# EAGLE design breakout_ble113 (EAGLE 7.4.0)
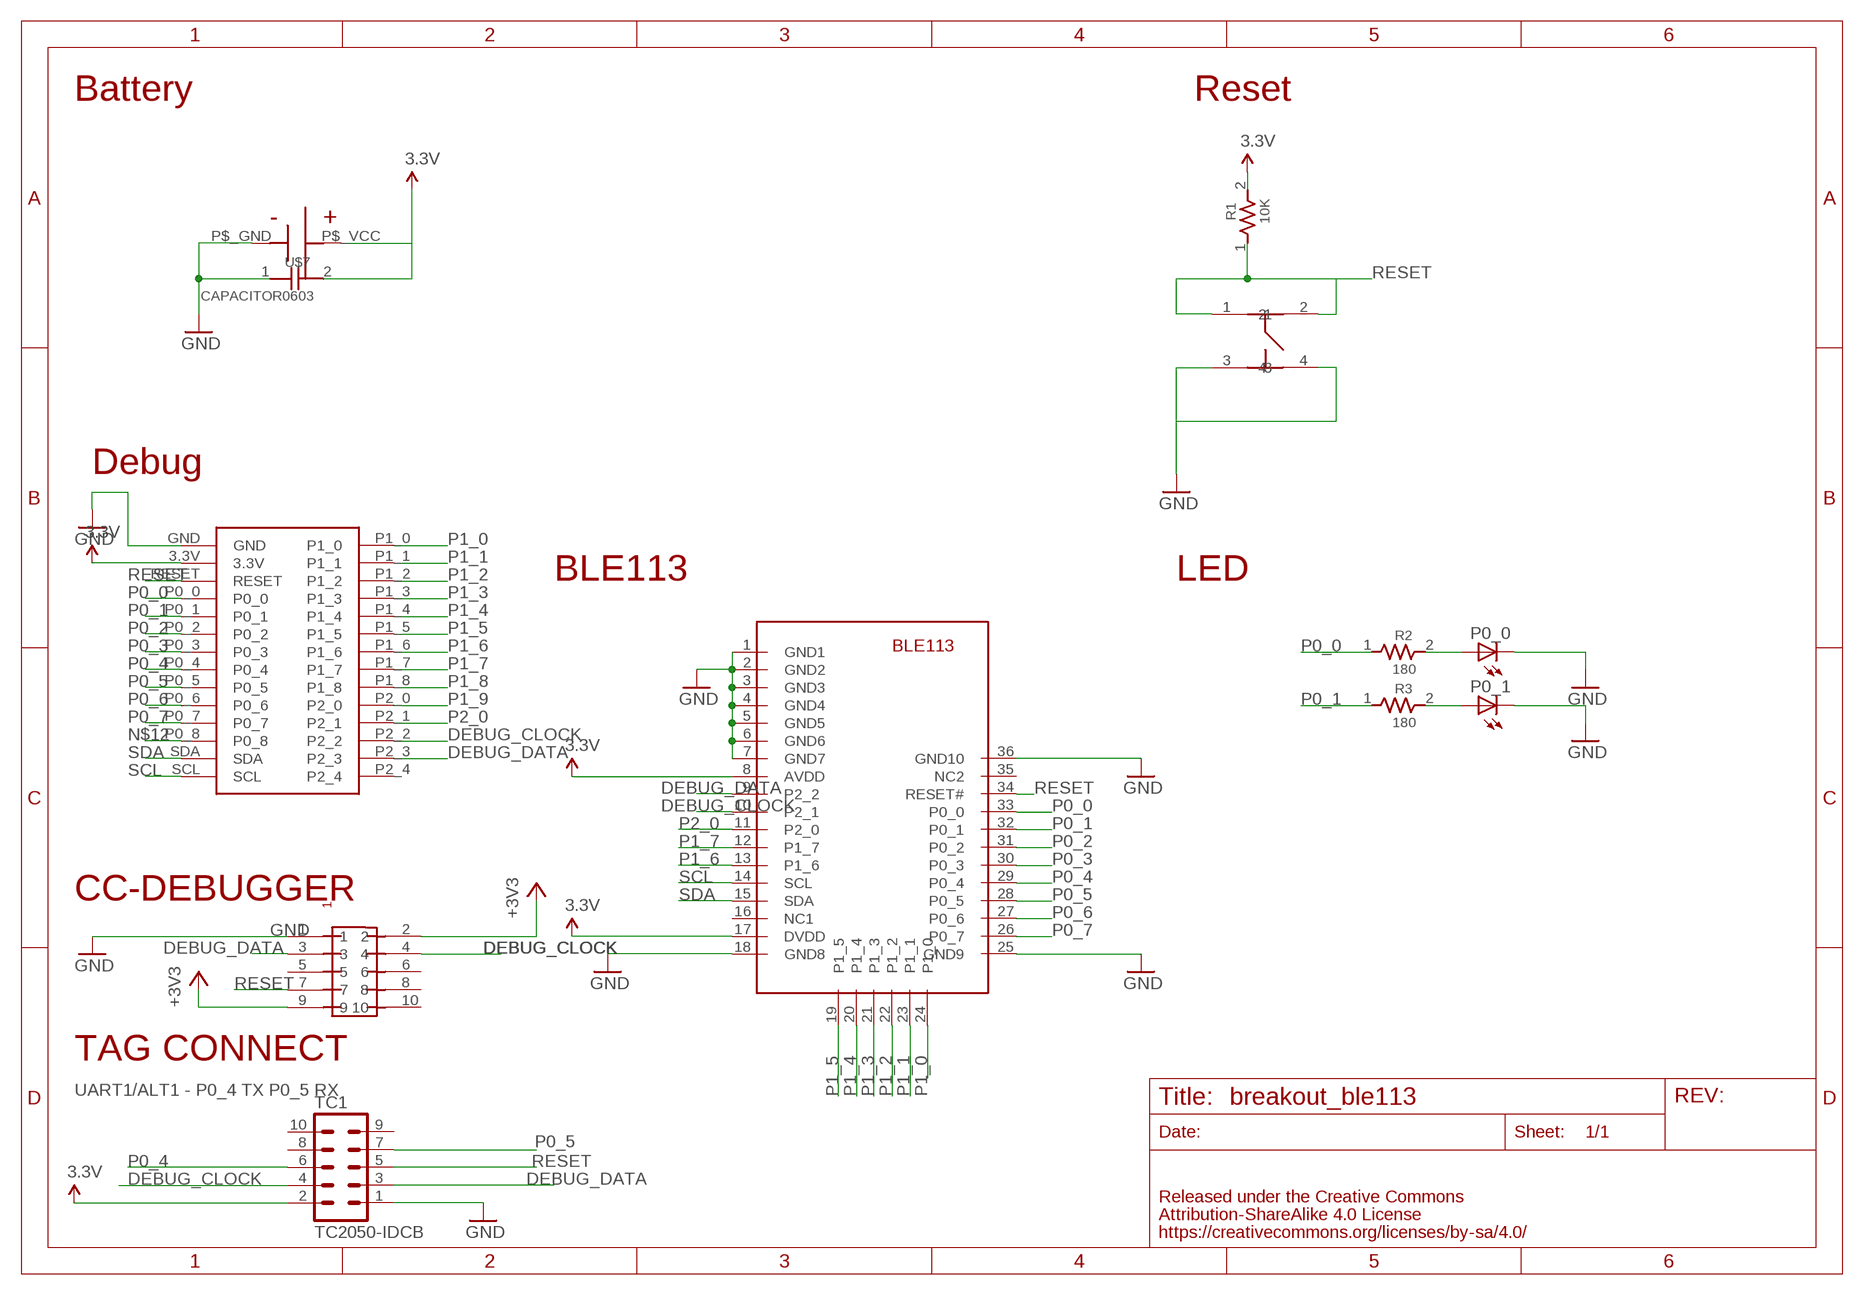
[diagram p0: schematic, sheet 1]

## Parts
P0_0  LEDCHIP-LED0603  [CHIP-LED0603]
P0_1  LEDCHIP-LED0603  [CHIP-LED0603]
R1  10K  RESISTOR0603  [0603]
R2  180  RESISTOR0603  [0603]
R3  180  RESISTOR0603  [0603]
TC1  TC2050-IDCB  [TC2050-IDC]
U$1  PIN-HEADER-SMT(1.27MM)2X5  [PIN-HEADER-SMT(1.27MM)2X5]
U$2  BREAKOUT_BLE  [BREAKOUT_BLE]
U$3  BLUEGIGA-BLE113  [BLUEGIGA-BLE113]
U$4  SMTU2450-TOP  [SMTU2450]
U$5  SWICTH-4P(KMR2)  [SWITCH-4P(KMR2)]
U$7  CAPACITOR0603  [0603]

## Nets
3.3V: R1.2 TC1.2 U$2.3.3V U$3.8(AVDD) U$3.17(DVDD) U$4.P$_VCC(+) U$7.2
+3V3: U$1.2 U$1.9
DEBUG_CLOCK: TC1.4 U$1.4 U$2.P2_2 U$3.10(P2_1)
DEBUG_DATA: TC1.3 U$1.3 U$2.P2_3 U$3.9(P2_2)
GND: P0_0.C P0_1.C TC1.1 U$1.1 U$2.GND U$3.1(GND1) U$3.2(GND2) U$3.3(GND3) U$3.4(GND4) U$3.5(GND5) U$3.6(GND6) U$3.7(GND7) U$3.18(GND8) U$3.25(GND9) U$3.36(GND10) U$4.P$_GND(-) U$5.3 U$5.4 U$7.1
N$12: U$2.P0_8
P0_0: R2.1 U$2.P0_0 U$3.33(P0_0)
P0_1: R3.1 U$2.P0_1 U$3.32(P0_1)
P0_2: U$2.P0_2 U$3.31(P0_2)
P0_3: U$2.P0_3 U$3.30(P0_3)
P0_4: TC1.6 U$2.P0_4 U$3.29(P0_4)
P0_5: TC1.7 U$2.P0_5 U$3.28(P0_5)
P0_6: U$2.P0_6 U$3.27(P0_6)
P0_7: U$2.P0_7 U$3.26(P0_7)
P1_0: U$2.P1_0 U$3.24(P1_0)
P1_1: U$2.P1_1 U$3.23(P1_1)
P1_2: U$2.P1_2 U$3.22(P1_2)
P1_3: U$2.P1_3 U$3.21(P1_3)
P1_4: U$2.P1_4 U$3.20(P1_4)
P1_5: U$2.P1_5 U$3.19(P1_5)
P1_6: U$2.P1_6 U$3.13(P1_6)
P1_7: U$2.P1_7 U$3.12(P1_7)
P1_8: U$2.P1_8
P1_9: U$2.P2_0
P2_0: U$2.P2_1 U$3.11(P2_0)
R1: P0_1.A R3.2
R2: P0_0.A R2.2
RESET: R1.1 TC1.5 U$1.7 U$2.RESET U$3.34(RESET#) U$5.1 U$5.2
SCL: U$2.SCL U$3.14(SCL)
SDA: U$2.SDA U$3.15(SDA)
Unconnected: TC1.8 TC1.9 TC1.10 U$1.5 U$1.6 U$1.8 U$1.10 U$2.P2_4 U$3.16(NC1) U$3.35(NC2)

## Notes on the sheet
- Battery | Reset
- Debug
- BLE113 | LED
- CC-DEBUGGER
- TAG CONNECT
- UART1/ALT1 - P0_4 TX P0_5 RX

## Library data of the parts
P0_0 P0_1 = led:LED: LED OSRAM: - CHIPLED LG R971, LG N971, LY N971, LG Q971, LY Q971, LO R971, LY R971 LH N974, LH R974 LS Q976, LO Q976, LY Q976 LO Q996 - Hyper CHIPLED LW Q18S LB Q993, LB Q99A, LB R99A - SideLED LS A670, LO A670, LY A670, LG A670, LP A670 LB A673, LV A673, LT A673, LW A673 LH A674 LY A675 LS A676, LA A676, LO A676, LY A676, LW A676 LS A679, LY A679, LG A679 - Hyper Micro SIDELED® LS Y876, LA Y876, LO Y876, LY Y876 LT Y87S - SmartLED LW L88C, LW L88S LB L89C, LB L89S, LG L890 LS L89K, LO L89K, LY L89K LS L896, LA L896, LO L896, LY L896 - TOPLED LS T670, LO T670, LY T670, LG T670, LP T670 LSG T670, LSP T670, LSY T670, LOP T670, LYG T670 LG T671, LOG T671, LSG T671 LB T673, LV T673, LT T673, LW T673 LH T674 LS T676, LA T676, LO T676, LY T676, LB T676, LH T676, LSB T676, LW T676 LB T67C, LV T67C, LT T67C, LS T67K, LO T67K, LY T67K, LW E67C LS E67B, LA E67B, LO E67B, LY E67B, LB E67C, LV E67C, LT E67C LW T67C LS T679, LY T679, LG T679 LS T770, LO T770, LY T770, LG T770, LP T770 LB T773, LV T773, LT T773, LW T773 LH T774 LS E675, LA E675, LY E675, LS T675 LS T776, LA T776, LO T776, LY T776, LB T776 LHGB T686 LT T68C, LB T68C - Hyper Mini TOPLED® LB M676 - Mini TOPLED Santana® LG M470 LS M47K, LO M47K, LY M47K Source: http://www.osram.convergy.de LUXEON: - LUMILED® LXK2-PW12-R00, LXK2-PW12-S00, LXK2-PW14-U00, LXK2-PW14-V00 LXK2-PM12-R00, LXK2-PM12-S00, LXK2-PM14-U00 LXK2-PE12-Q00, LXK2-PE12-R00, LXK2-PE12-S00, LXK2-PE14-T00, LXK2-PE14-U00 LXK2-PB12-K00, LXK2-PB12-L00, LXK2-PB12-M00, LXK2-PB14-N00, LXK2-PB14-P00, LXK2-PB14-Q00 LXK2-PR12-L00, LXK2-PR12-M00, LXK2-PR14-Q00, LXK2-PR14-R00 LXK2-PD12-Q00, LXK2-PD12-R00, LXK2-PD12-S00 LXK2-PH12-R00, LXK2-PH12-S00 LXK2-PL12-P00, LXK2-PL12-Q00, LXK2-PL12-R00 Source: www.luxeon.com KINGBRIGHT: KA-3528ASYC Source: www.kingbright.com
R1-R3 = GClue-Resistors:RESISTOR
TC1 = TagConnect:TC2050-IDC: Tag-Connect In Circuit Programming & Debug Cable 10 Pin http://www.tag-connect.com
U$1 = gclue:PIN-HEADER-SMT(1.27MM)2X5: PIN-HEADER-SMT (1.27MM) 2x5
U$2 = gclue:BREAKOUT_BLE
U$3 = GClueBT:BLUEGIGA-BLE113: Bluegiga BLE113 Bluetooth Bluetooth 4.0 low energy radio Radio Transmit power: +0 dBm Receiver sensitivity: -93 dBm Typical line-of-sight range: 30 - 100 meters Current Consumption TX peak current: 18.2 mA, 14.3 ma (with DC/DC) RX peak current: 17.9 mA Power mode 1: 270 uA Power mode 2: 1 uA Power mode 3: 0.4 uA Certifications Japan: MIC Japan( 007-AB0103)
U$4 = GClue-Supply:SMTU2450-TOP
U$5 = gclue-test:SWICTH-4P(KMR2)
U$7 = GClue-Capacitor:CAPACITOR

## Net classes
0 default: width 0.203 mm, clearance 0.254 mm

## Board
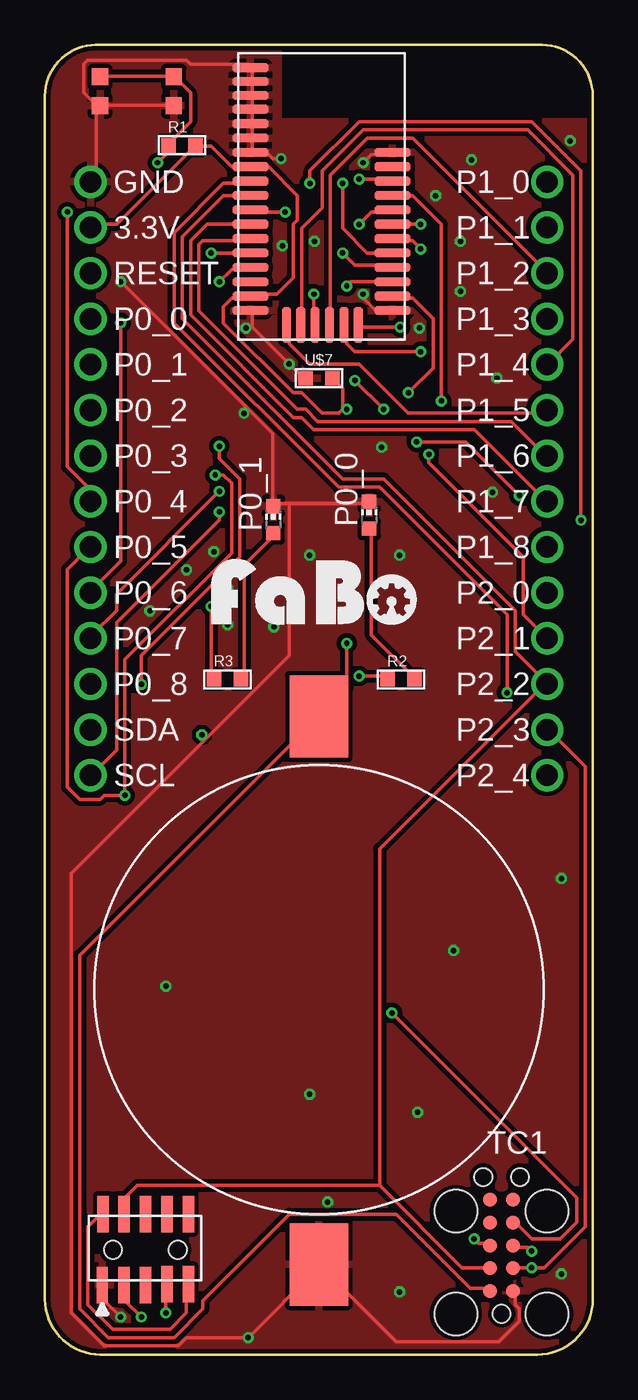
[diagram p1: board, top side]
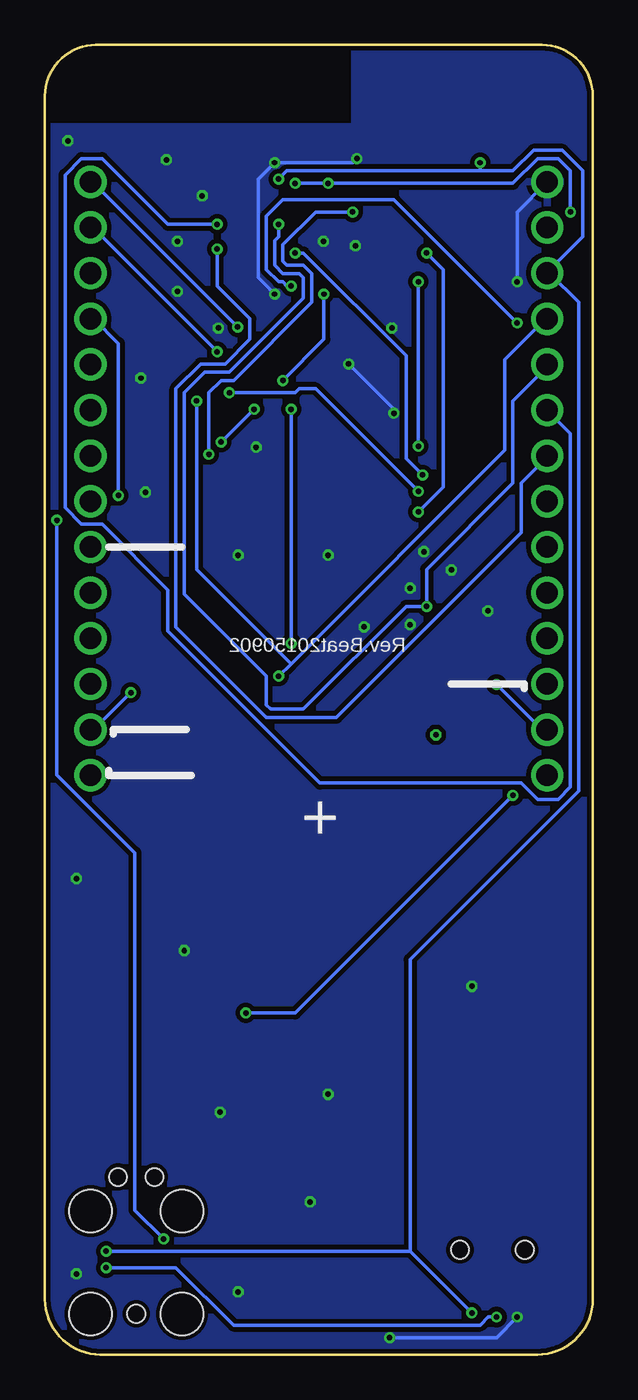
[diagram p2: board, bottom side, seen from below]

Size 30.48 x 72.88 mm. Coordinates in mm from the lower left corner, seen from the top.
Copper layers (1*16): Top 0.035mm / dielectric 1.5mm / Bottom 0.035mm
Design rules "SeeedStudio_2layer_DRU_no_angle_20140221": minimum track width 6mil, minimum drill 12mil, track to track 6mil, track to pad 6mil, pad to pad 6mil, via to via 6mil, smd to smd 0mil, copper to edge 10mil, drill to drill 10mil, minimum pad ring 10mil, minimum via ring 6mil, stop-mask expansion 2mil, vias tented up to drill 100mil, thermal gap 10mil
tRestrict: area 13.2,68.8 to 33.5,74.4
bRestrict: area 13.5,68.6 to 33.5,74.4

### Footprints (pad centres in the part's own frame; a part is rotated, then mirrored left to right if it is on the bottom)
CHIP-LED0603 = smd 0.8 x 0.8: A 0,-0.75; C 0,0.75
0603 = smd 0.8 x 0.8: 1 -0.75,0; 2 0.75,0
TC2050-IDC = smd 0.787 x 0.787: 1 -2.54,-0.635; 2 -2.54,0.635; 3 -1.27,-0.635; 4 -1.27,0.635; 5 0,-0.635; 6 0,0.635; 7 1.27,-0.635; 8 1.27,0.635; 9 2.54,-0.635; 10 2.54,0.635 | hole 0.991: -3.81,0; 3.81,1.016; 3.81,-1.016 | hole 2.375: -3.81,2.54; -3.81,-2.54; 1.905,2.54; 1.905,-2.54
PIN-HEADER-SMT(1.27MM)2X5 = smd 0.635 x 2.032: 1 -2.4,-1.95; 2 -2.35,2; 3 -1.2,-1.95; 4 -1.2,2; 5 0,-1.95; 6 0,2; 7 1.2,-1.9; 8 1.2,2; 9 2.4,-1.9; 10 2.4,2 | hole 1: 1.8,0; -1.8,0
BREAKOUT_BLE = drill 1.2: 3.3V -12.7,10.16; GND -12.7,12.7; P0_0 -12.7,5.08; P0_1 -12.7,2.54; P0_2 -12.7,0; P0_3 -12.7,-2.54; P0_4 -12.7,-5.08; P0_5 -12.7,-7.62; P0_6 -12.7,-10.16; P0_7 -12.7,-12.7; P0_8 -12.7,-15.24; P1_0 12.7,12.7; P1_1 12.7,10.16; P1_2 12.7,7.62; P1_3 12.7,5.08; P1_4 12.7,2.54; P1_5 12.7,0; P1_6 12.7,-2.54; P1_7 12.7,-5.08; P1_8 12.7,-7.62; P2_0 12.7,-10.16; P2_1 12.7,-12.7; P2_2 12.7,-15.24; P2_3 12.7,-17.78; P2_4 12.7,-20.32; RESET -12.7,7.62; SCL -12.7,-20.32; SDA -12.7,-17.78
BLUEGIGA-BLE113 = smd 2 x 0.5: 1 -3.81,6.35; 2 -3.81,5.58; 3 -3.81,4.81; 4 -3.81,4.04; 5 -3.81,3.24; 6 -3.81,2.44; 7 -3.81,1.64; 8 -3.81,0.84; 9 -3.81,0.04; 10 -3.81,-0.76; 11 -3.81,-1.56; 12 -3.81,-2.36; 13 -3.81,-3.16; 14 -3.81,-3.96; 15 -3.81,-4.76; 16 -3.81,-5.56; 17 -3.81,-6.36; 18 -3.81,-7.16; 25 4.09,-7.16; 26 4.09,-6.36; 27 4.09,-5.56; 28 4.09,-4.76; 29 4.09,-3.96; 30 4.09,-3.16; 31 4.09,-2.36; 32 4.09,-1.56; 33 4.09,-0.76; 34 4.09,0.04; 35 4.09,0.84; 36 4.09,1.64 | smd 0.5 x 2: 19 -1.81,-7.96; 20 -1.01,-7.96; 21 -0.21,-7.96; 22 0.59,-7.96; 23 1.39,-7.96; 24 2.19,-7.96
SMTU2450 = smd 3.251 x 4.572: P$_GND 0,-15.29; P$_VCC 0,15.21
SWITCH-4P(KMR2) = smd 0.9 x 0.95: 1 -1,0; 2 3.1,0; 3 -1,-1.6; 4 3.1,-1.6

### Placement (x,y rotation side)
P0_0  18.03,46.72 0 top
P0_1  12.7,46.46 0 top
R1  7.62,67.29 0 top
R2  19.81,37.57 0 top
R3  10.16,37.57 0 top
TC1  25.4,6.08 90 top
U$1  5.59,5.82 0 top
U$2  15.24,52.56 0 top
U$3  15.24,65.26 0 top
U$4  15.24,20.3 0 top
U$5  4.06,71.1 0 top
U$7  15.24,54.34 0 top
U$8  [LOGO_FABO_M]  14.99,40.62 0 top

### Tracks (layer width: path | path; a pad name or v marks a point on that pad's centre or on a via)
3.3V  (via drill 0.3)
  Top 0.203: 16.56,52.61 16.56,53.75 16.1,54.21 U$7.2 | 16.56,52.61 16.33,52.38 15.42,52.38 14.27,53.52 13.82,53.52 9.93,57.41 9.93,58.33 10.39,58.78 11.3,58.78 U$3.17 11.53,59.01 12.9,59.01 13.82,59.93 13.82,62.9 14.05,63.13 14.05,64.5 12.45,66.1 11.53,66.1 U$3.8 11.3,66.1 10.39,66.1 9.25,67.24 8.56,67.24 R1.2 8.33,67.24 3.99,62.9 2.62,62.9 U$2.3.3V | TC1.2 24.56,3.69 23.65,3.69 19.53,7.81 13.59,7.81 8.79,3.01 8.79,2.55 7.19,0.95 3.53,0.95 1.93,2.55 1.93,22.21 15.19,35.47 U$4.P$_VCC 15.42,35.69 16.79,37.07 v16.79,39.58 | v16.79,52.61 16.56,52.61
  Bottom 0.203: v16.79,39.58 v16.79,52.61
+3V3
  Top 0.203: U$1.9 7.87,3.92 7.87,2.32 6.96,1.4 3.76,1.4 2.39,2.78 2.39,7.12 3.07,7.81 U$1.2
DEBUG_CLOCK
  Top 0.203: 18.62,9.41 23.19,4.83 24.56,4.83 TC1.4 | 18.62,9.41 5.13,9.41 4.44,8.72 4.44,8.03 U$1.4 | U$3.10 11.3,64.5 9.93,64.5 7.64,62.21 7.64,57.64 16.56,48.73 18.85,48.73 26.16,41.41 26.16,39.12 27.76,37.52 U$2.P2_2 27.76,37.3 18.62,28.15 18.62,9.41
DEBUG_DATA  (via drill 0.3)
  Top 0.203: TC1.3 26.16,4.83 v27.08,4.83 27.76,4.83 30.05,7.12 30.05,32.72 27.99,34.78 U$2.P2_3 | v25.7,36.84 25.7,41.18 18.62,48.27 16.33,48.27 7.19,57.41 7.19,62.44 9.93,65.18 11.3,65.18 U$3.9 | v5.36,2.09 4.44,3.01 4.44,3.69 U$1.3
  Bottom 0.203: v25.7,36.84 27.76,34.78 U$2.P2_3 | v5.36,2.09 5.82,2.09 6.27,1.63 19.99,1.63 23.19,4.83 v27.08,4.83
GND  (via drill 0.3)
  Top 0.203: TC1.1 26.16,3.46 26.16,2.78 26.39,2.55 26.39,1.86 25.25,0.72 19.53,0.72 15.42,4.83 U$4.P$_GND 15.19,4.83 v11.3,0.95 7.87,0.95 7.42,0.49 3.3,0.49 1.47,2.32 1.47,26.78 13.59,38.9 13.59,47.35 | v4.22,2.09 3.3,3.01 3.3,3.69 U$1.1 | v17.7,59.01 17.7,58.78 18.39,58.1 19.3,58.1 U$3.25 | v17.7,66.33 18.16,66.78 19.3,66.78 U$3.36 | U$7.1 14.27,54.44 v13.59,55.12 11.53,57.18 11.53,58.1 U$3.18 | 13.59,47.35 17.93,47.35 P0_0.C | 13.59,47.35 12.9,47.35 P0_1.C 12.67,47.35 12.67,51.24 11.3,52.61 | U$5.3 3.07,69.53 6.96,69.53 U$5.4 | U$5.3 2.84,69.3 2.84,65.64 2.62,65.41 U$2.GND | v4.22,59.7 11.3,52.61 | U$5.3 2.84,69.53 2.16,70.21 2.16,71.81 2.39,72.04 7.87,72.04 8.1,71.81 11.3,71.81 U$3.1 11.53,71.59 11.53,70.9 U$3.2 11.53,70.67 11.53,70.21 U$3.3 11.53,69.98 11.53,69.53 U$3.4 11.53,69.3 11.53,68.61 U$3.5 11.53,68.38 11.53,67.93 U$3.6 11.53,67.7 11.53,67.01 U$3.7 11.53,66.78 12.45,66.78 12.67,66.56 v13.13,66.56 | 11.3,52.61 v11.07,52.38
  Bottom 0.203: v4.22,2.09 5.36,0.95 v11.3,0.95 | v17.7,59.01 18.62,59.93 18.62,65.41 v17.7,66.33 13.36,66.33 v13.13,66.56 | v4.22,59.7 4.22,63.58 U$2.GND | v13.59,55.12 11.07,52.61 v11.07,52.38
  other vias: 6.73,20.49 14.73,14.49 22.73,22.49 20.73,13.49 28.73,26.49 15.73,8.49 19.73,3.49 12.73,40.49 14.73,44.49 19.73,44.49 28.73,4.49 18.73,50.49 23.73,66.49 21.73,64.49 9.4,44.69 7.87,43.67 5.84,41.38 10.16,42.65 10.16,40.62 25.15,54.34 24.89,47.99 11.18,57.13 14.99,61.96 13.21,61.7 29.21,67.55 23.11,61.96 23.11,59.16 20.83,57.13
  pour Bottom: -1.27,-1.51 32.73,-1.51 32.73,73.49 -1.27,73.49
  pour Top: -1.27,-1.51 32.73,-1.51 32.73,73.49 -1.27,73.49
N$4  (via drill 0.3)
  other vias: 8.73,34.49
P0_0  (via drill 0.3)
  Top 0.203: v17.48,37.75 18.85,37.75 R2.1 | v22.05,53.07 22.05,62.9 20.45,64.5 19.53,64.5 U$3.33
  Bottom 0.203: 16.79,38.44 4.9,50.33 4.9,55.35 2.62,57.64 U$2.P0_0 | 16.79,38.44 v17.48,37.75 | v22.05,53.07 22.05,43.7 16.79,38.44
P0_1  (via drill 0.3)
  Top 0.203: v9.25,41.64 9.25,37.75 R3.1 | v17.48,62.9 18.16,63.58 19.3,63.58 U$3.32
  Bottom 0.203: U$2.P0_1 2.62,54.9 4.44,53.07 4.44,48.5 9.25,43.7 v9.25,41.64 10.39,41.64 16.1,35.92 17.93,35.92 18.16,36.15 18.16,37.75 22.73,42.32 22.73,53.52 21.59,54.67 20.22,54.67 16.1,58.78 16.1,59.93 16.33,60.16 17.25,60.16 17.7,60.61 17.7,61.98 17.48,62.21 v17.48,62.9
P0_2  (via drill 0.3)
  Top 0.203: v20.9,62.9 19.53,62.9 U$3.31
  Bottom 0.203: v20.9,62.9 23.65,62.9 27.3,66.56 28.45,66.56 29.36,65.64 29.36,47.12 28.45,46.21 27.3,46.21 23.65,42.55 23.65,40.27 15.19,31.81 3.99,31.81 3.07,30.89 1.93,30.89 1.24,31.58 1.24,51.24 2.39,52.38 U$2.P0_2
P0_3  (via drill 0.3)
  Top 0.203: v20.9,61.53 20.45,61.98 19.53,61.98 U$3.30
  Bottom 0.203: v20.9,61.53 20.9,59.47 19.07,57.64 19.07,56.5 20.45,55.12 21.82,55.12 23.19,53.75 23.19,40.5 18.16,35.47 14.27,35.47 3.99,45.75 3.99,48.5 2.62,49.87 U$2.P0_3
P0_4  (via drill 0.3)
  Top 0.203: v23.88,6.43 24.1,6.21 24.56,6.21 TC1.6 | v29.82,46.44 29.82,65.87 27.08,68.61 17.48,68.61 14.73,65.87 v14.73,65.18 | v16.56,65.18 16.56,62.67 17.93,61.3 19.3,61.3 U$3.29 | v1.24,63.58 1.24,49.41 2.39,48.27 2.39,47.58 U$2.P0_4
  Bottom 0.203: v23.88,6.43 25.48,8.03 25.48,27.92 29.82,32.27 v29.82,46.44 | v16.56,65.18 v14.73,65.18 4.44,65.18 3.07,66.56 1.93,66.56 1.24,65.87 v1.24,63.58
P0_5  (via drill 0.3)
  Top 0.203: v19.3,19.01 29.59,8.72 29.59,7.35 28.68,6.43 27.08,6.43 26.16,7.35 TC1.7 | U$2.P0_5 2.39,44.84 1.24,43.7 1.24,31.58 1.93,30.89 3.07,30.89 3.3,31.12 v4.44,31.12 4.44,38.67 10.39,44.61 10.39,48.5 9.93,48.95 v9.47,48.95 | v16.56,61.3 17.25,60.61 19.3,60.61 U$3.28
  Bottom 0.203: v19.3,19.01 16.56,19.01 v4.44,31.12 | v16.56,61.3 16.1,61.3 10.39,55.58 10.39,49.87 v9.47,48.95
P0_6  (via drill 0.3)
  Top 0.203: v16.79,59.47 17.02,59.7 19.3,59.7 U$3.27 | v4.22,57.41 4.22,44.15 2.62,42.55 U$2.P0_6
  Bottom 0.203: v16.79,59.47 17.02,59.47 17.25,59.7 17.48,59.7 18.16,60.38 18.16,63.36 17.25,64.27 11.07,64.27 v4.22,57.41
P0_7  (via drill 0.3)
  Top 0.203: v20.22,53.52 21.59,54.9 21.59,57.64 20.45,58.78 19.53,58.78 U$3.26 | v9.7,48.04 3.99,42.32 3.99,41.41 2.62,40.04 U$2.P0_7
  Bottom 0.203: v20.22,53.52 16.56,53.52 16.33,53.75 15.42,53.75 v9.7,48.04
P1_0  (via drill 0.3)
  Top 0.203: v19.76,57.18 17.48,57.18 U$3.24
  Bottom 0.203: v19.76,57.18 27.76,65.18 U$2.P1_0
P1_1  (via drill 0.3)
  Top 0.203: v20.9,55.81 17.25,55.81 16.79,56.27 16.79,57.18 U$3.23
  Bottom 0.203: v20.9,55.81 27.76,62.67 U$2.P1_1
P1_2
  Top 0.203: U$3.22 15.87,57.41 15.87,65.64 17.93,67.7 20.45,67.7 27.76,60.38 U$2.P1_2
P1_3  (via drill 0.3)
  Top 0.203: v14.96,59.01 14.96,57.41 U$3.21 | v18.85,52.61 v17.25,54.21 | v20.68,50.78 23.42,50.78 v26.39,47.81
  Bottom 0.203: v14.96,59.01 14.96,56.5 v17.25,54.21 | v20.68,50.78 v18.85,52.61 | v26.39,47.81 26.39,56.27 27.76,57.64 U$2.P1_3
P1_4
  Top 0.203: U$3.20 14.27,57.41 14.27,62.67 15.42,63.81 15.42,65.87 17.7,68.16 26.85,68.16 29.36,65.64 29.36,56.5 27.99,55.12 U$2.P1_4
P1_5
  Top 0.203: U$3.19 13.59,57.18 13.59,56.27 14.73,55.12 17.48,55.12 20.22,52.38 27.76,52.38 U$2.P1_5
P1_6
  Top 0.203: U$3.13 11.3,61.98 8.79,61.98 8.56,61.76 8.56,58.1 14.05,52.61 14.5,52.61 15.19,51.93 25.93,51.93 27.76,50.1 U$2.P1_6
P1_7
  Top 0.203: U$3.12 11.3,62.9 9.02,62.9 8.1,61.98 8.1,57.87 13.82,52.15 14.27,52.15 14.96,51.47 23.88,51.47 27.76,47.58 U$2.P1_7
P2_0  (via drill 0.3)
  Top 0.203: v13.36,63.58 11.53,63.58 U$3.11 | v21.36,50.1 21.36,49.64 26.62,44.38 26.62,41.18 U$2.P2_1
  Bottom 0.203: v13.36,63.58 15.42,63.58 17.25,61.76 17.25,60.84 17.02,60.61 16.1,60.61 15.65,60.16 15.65,58.55 19.99,54.21 20.68,54.21 21.36,53.52 v21.36,50.1
R1
  Top 0.203: R3.2 11.07,37.75 11.07,43.92 12.67,45.52 P0_1.A
R2
  Top 0.203: P0_0.A 18.16,45.75 18.16,40.04 20.45,37.75 R2.2
RESET  (via drill 0.3)
  Top 0.203: v27.08,5.75 26.85,5.98 26.16,5.98 TC1.5 | v6.73,2.32 6.73,3.92 U$1.7 | U$5.1 3.07,71.13 6.96,71.13 U$5.2 7.19,71.13 8.1,70.21 8.1,68.61 6.96,67.47 R1.1 6.73,67.24 6.73,66.78 v6.27,66.33 | v17.48,65.41 19.3,65.41 U$3.34
  Bottom 0.203: 10.16,5.75 v27.08,5.75 | v6.73,2.32 10.16,5.75 | v17.48,65.41 17.02,65.87 6.27,65.87 | 6.27,65.87 4.44,65.87 3.3,67.01 1.7,67.01 0.56,65.87 0.56,62.21 2.39,60.38 U$2.RESET 2.39,60.16 0.79,58.55 0.79,31.35 10.16,21.98 10.16,5.75 | 6.27,65.87 v6.27,66.33
SCL  (via drill 0.3)
  Top 0.203: v9.25,61.3 11.3,61.3 U$3.14 | v9.7,46.9 9.7,46.44 3.99,40.72 3.99,33.64 2.62,32.27 U$2.SCL
  Bottom 0.203: v9.25,61.3 8.33,60.38 8.33,48.27 v9.7,46.9
SDA  (via drill 0.3)
  Top 0.203: v9.7,59.7 10.39,60.38 11.3,60.38 U$3.15 | v9.7,50.55 9.7,49.87 10.85,48.73 10.85,44.38 5.36,38.9 v5.36,37.3
  Bottom 0.203: v9.7,50.55 v9.7,59.7 | v5.36,37.3 2.84,34.78 U$2.SDA

### Text on the board
bPlace: Rev.Beat20150902